# EAGLE design roomba (EAGLE 9.2.0)
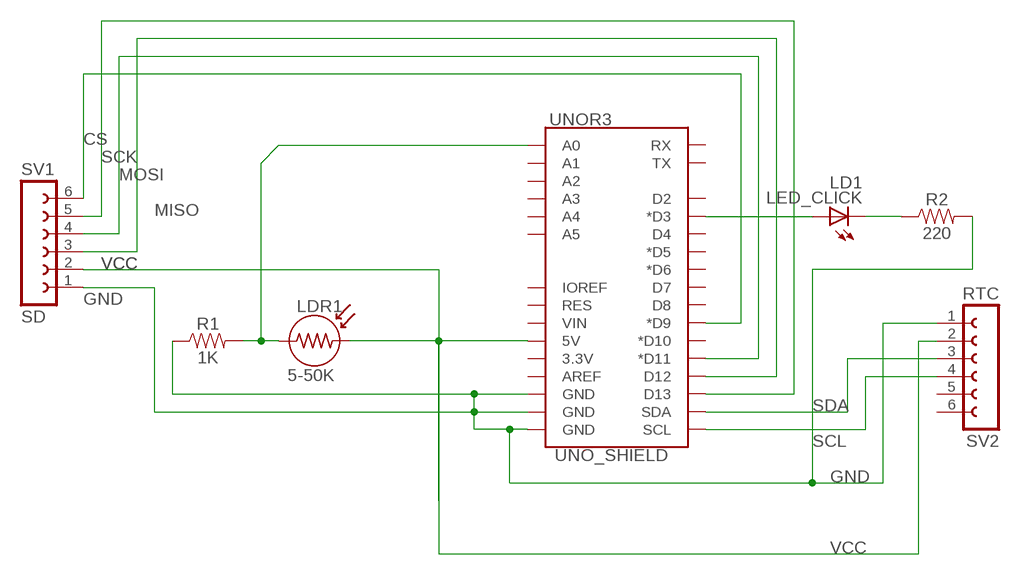
[diagram p0: schematic, sheet 1]

## Parts
LDR1  5-50K  LDR  [LDR]
LED_CLICK  LD1  LED3MM  [LED3MM]
R1  1K  1KOHM-HORIZ-1/4W-1%  [AXIAL-0.3]
R2  220  1KOHM-HORIZ-1/4W-1%  [AXIAL-0.3]
SV1  SD  FE06-1  [FE06]
SV2  RTC  FE06W  [FE06W]
UNOR3  UNO_SHIELD  ARDUINO_UNO_R3_SHIELDNOLABELS  [UNO_R3_SHIELD_NOLABELS]

## Nets
CLICK: LED_CLICK.A UNOR3.D3(*D3)
CS: SV1.6 UNOR3.D9(*D9)
GND: R1.P$1 R2.P$2 SV1.1 SV2.1 UNOR3.GND@0(GND) UNOR3.GND@1(GND) UNOR3.GND@2(GND)
LECTURA: LDR1.1 R1.P$2 UNOR3.A0
MISO: SV1.3 UNOR3.D12
MOSI: SV1.4 UNOR3.D11(*D11)
RCLICK: LED_CLICK.K(C) R2.P$1
SCK: SV1.5 UNOR3.D13
SCL: SV2.4 UNOR3.SCL
SDA: SV2.3 UNOR3.SDA
VCC: LDR1.2 SV1.2 SV2.2 UNOR3.5V
Unconnected: SV2.5 SV2.6 UNOR3.3.3V UNOR3.A1 UNOR3.A2 UNOR3.A3 UNOR3.A4 UNOR3.A5 UNOR3.AREF UNOR3.D2 UNOR3.D4 UNOR3.D5(*D5) UNOR3.D6(*D6) UNOR3.D7 UNOR3.D8 UNOR3.D10(*D10) UNOR3.IOREF UNOR3.RES UNOR3.RX UNOR3.TX UNOR3.VIN

## Library data of the parts
LDR1 = E&R_Sensores:LDR: Fotoresistencia
LED_CLICK = led:LED: LED OSRAM: - CHIPLED LG R971, LG N971, LY N971, LG Q971, LY Q971, LO R971, LY R971 LH N974, LH R974 LS Q976, LO Q976, LY Q976 LO Q996 - Hyper CHIPLED LW Q18S LB Q993, LB Q99A, LB R99A - SideLED LS A670, LO A670, LY A670, LG A670, LP A670 LB A673, LV A673, LT A673, LW A673 LH A674 LY A675 LS A676, LA A676, LO A676, LY A676, LW A676 LS A679, LY A679, LG A679 - Hyper Micro SIDELED® LS Y876, LA Y876, LO Y876, LY Y876 LT Y87S - SmartLED LW L88C, LW L88S LB L89C, LB L89S, LG L890 LS L89K, LO L89K, LY L89K LS L896, LA L896, LO L896, LY L896 - TOPLED LS T670, LO T670, LY T670, LG T670, LP T670 LSG T670, LSP T670, LSY T670, LOP T670, LYG T670 LG T671, LOG T671, LSG T671 LB T673, LV T673, LT T673, LW T673 LH T674 LS T676, LA T676, LO T676, LY T676, LB T676, LH T676, LSB T676, LW T676 LB T67C, LV T67C, LT T67C, LS T67K, LO T67K, LY T67K, LW E67C LS E67B, LA E67B, LO E67B, LY E67B, LB E67C, LV E67C, LT E67C LW T67C LS T679, LY T679, LG T679 LS T770, LO T770, LY T770, LG T770, LP T770 LB T773, LV T773, LT T773, LW T773 LH T774 LS E675, LA E675, LY E675, LS T675 LS T776, LA T776, LO T776, LY T776, LB T776 LHGB T686 LT T68C, LB T68C - Hyper Mini TOPLED® LB M676 - Mini TOPLED Santana® LG M470 LS M47K, LO M47K, LY M47K Source: http://www.osram.convergy.de LUXEON: - LUMILED® LXK2-PW12-R00, LXK2-PW12-S00, LXK2-PW14-U00, LXK2-PW14-V00 LXK2-PM12-R00, LXK2-PM12-S00, LXK2-PM14-U00 LXK2-PE12-Q00, LXK2-PE12-R00, LXK2-PE12-S00, LXK2-PE14-T00, LXK2-PE14-U00 LXK2-PB12-K00, LXK2-PB12-L00, LXK2-PB12-M00, LXK2-PB14-N00, LXK2-PB14-P00, LXK2-PB14-Q00 LXK2-PR12-L00, LXK2-PR12-M00, LXK2-PR14-Q00, LXK2-PR14-R00 LXK2-PD12-Q00, LXK2-PD12-R00, LXK2-PD12-S00 LXK2-PH12-R00, LXK2-PH12-S00 LXK2-PL12-P00, LXK2-PL12-Q00, LXK2-PL12-R00 Source: www.luxeon.com KINGBRIGHT: KA-3528ASYC Source: www.kingbright.com
R1 R2 = SparkFun-Resistors:1KOHM: 1kΩ resistor A resistor is a passive two-terminal electrical component that implements electrical resistance as a circuit element. Resistors act to reduce current flow, and, at the same time, act to lower voltage levels within circuits. - Wikipedia; PROD_ID: RES-12182; SPICEPREFIX: R; VALUE: 1k
SV1 = con-lsta:FE06-1: FEMALE HEADER; OC_FARNELL: unknown; OC_NEWARK: unknown
SV2 = con-lsta:FE06W: FEMALE HEADER; OC_FARNELL: unknown; OC_NEWARK: unknown
UNOR3 = SparkFun-Boards:ARDUINO_UNO_R3_SHIELD: Arduino R3 Shield Footprint Shield form compatible with the Arduino Uno R3. SparkFun Products: MG2639 Cellular Shield <https://www.sparkfun.com/products/13120> MIDI Shield <https://www.sparkfun.com/products/12898> R3 Stackable Headers Kit <https://www.sparkfun.com/products/11417>

## Board
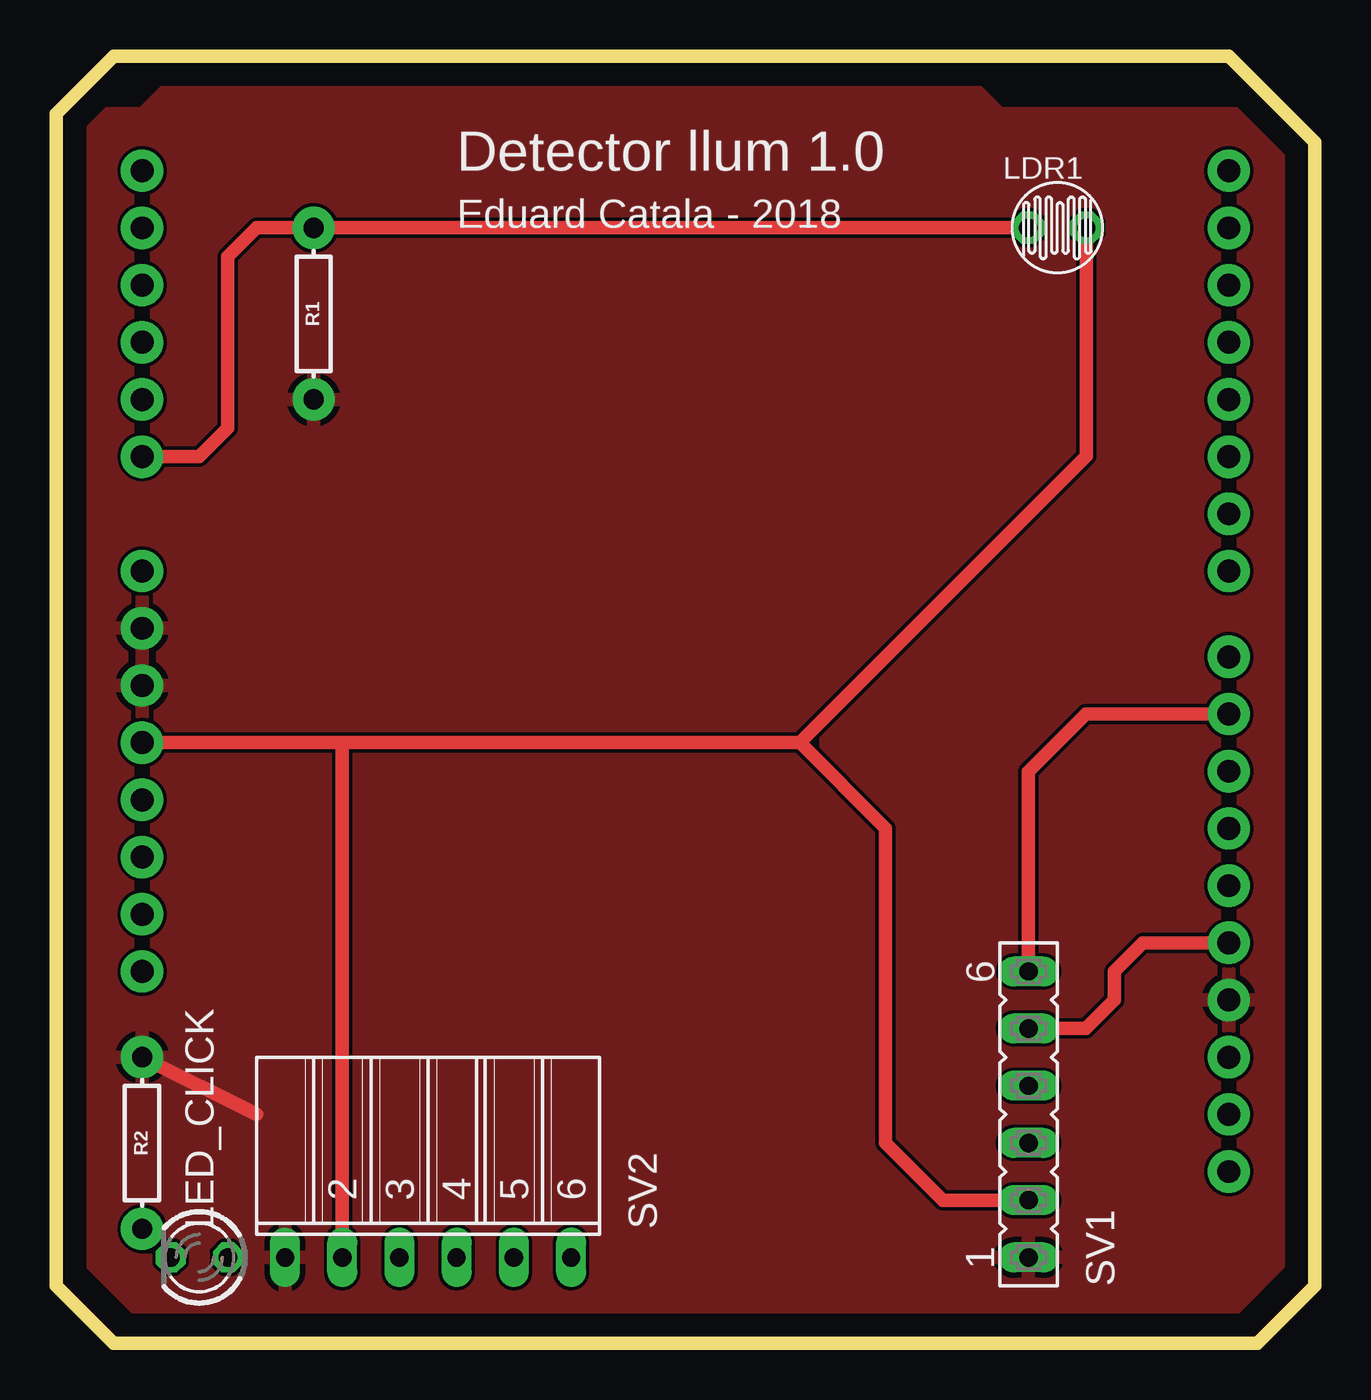
[diagram p1: board, top side]
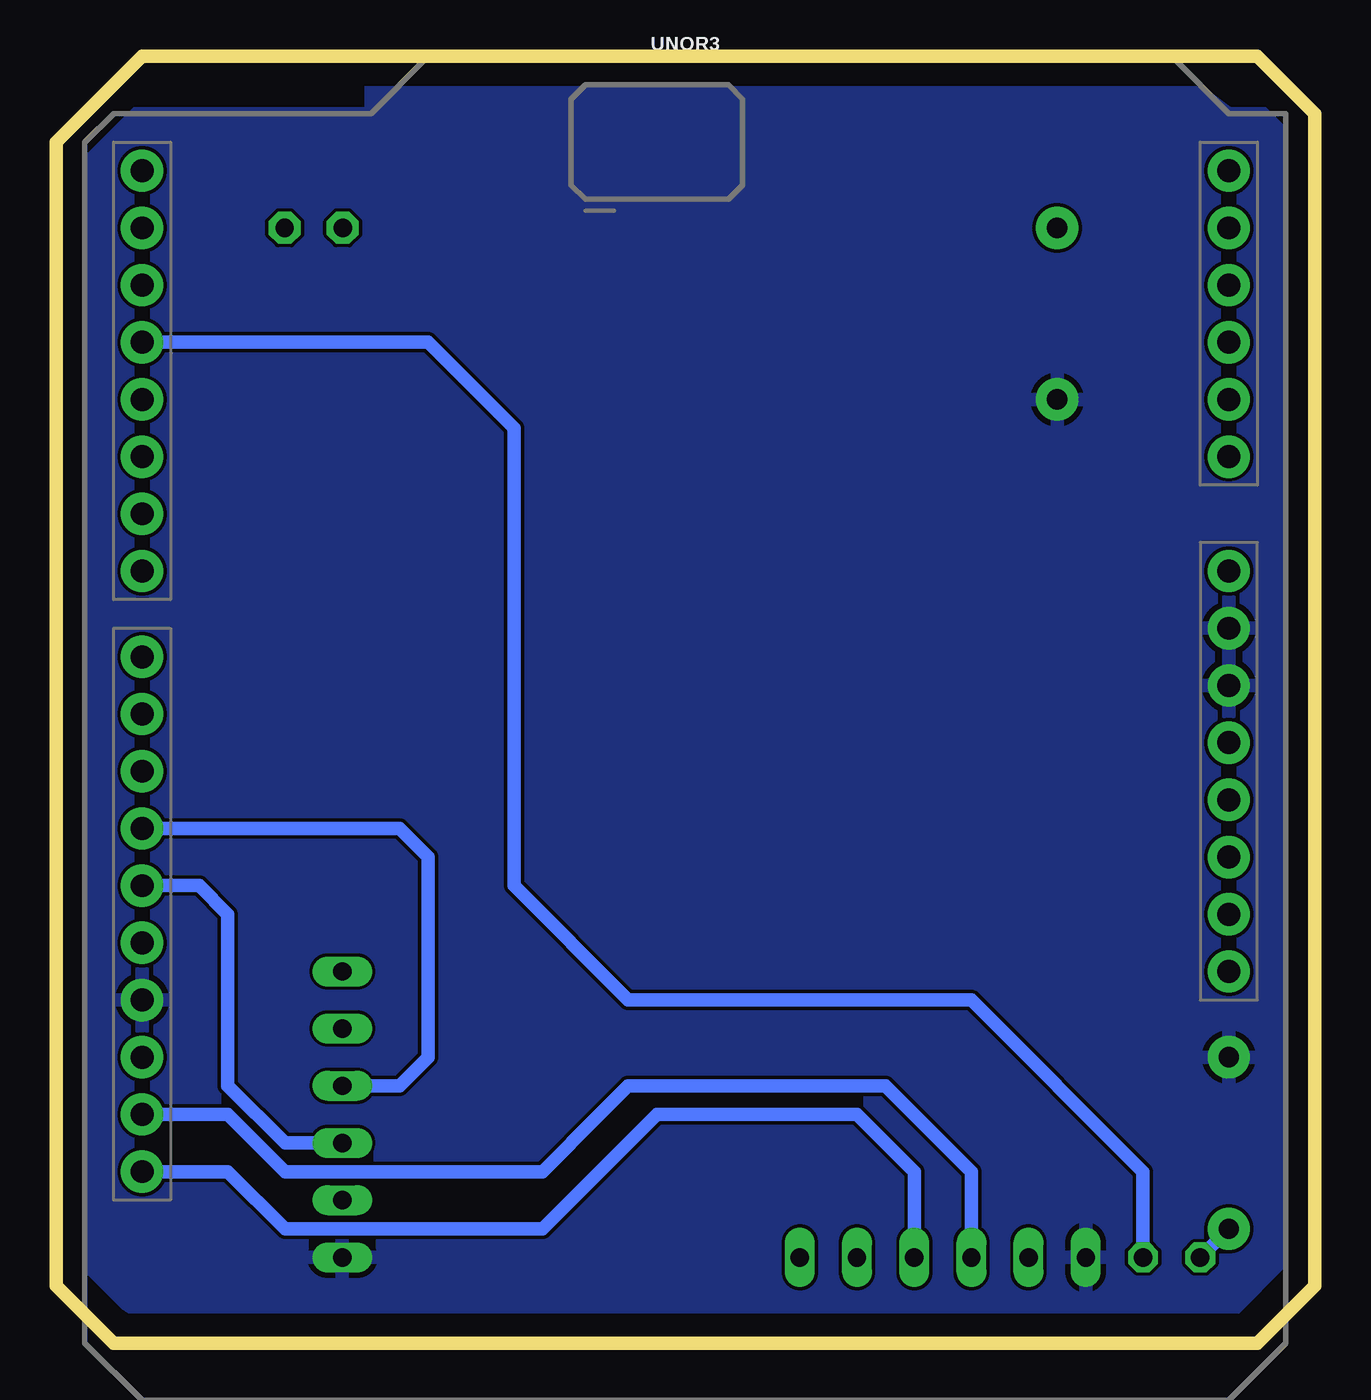
[diagram p2: board, bottom side, seen from below]

Size 55.88 x 57.15 mm. Coordinates in mm from the lower left corner, seen from the top.
Outline: 0,54.61 0,2.54 2.54,0 53.34,0 55.88,2.54 55.88,53.34 52.07,57.15 2.54,57.15 0,54.61
Copper layers (1*16): Top 0.035mm / dielectric 1.5mm / Bottom 0.035mm
Design rules "default": minimum track width 6mil, minimum drill 0.35mm, track to track 6mil, track to pad 6mil, pad to pad 6mil, via to via 6mil, smd to smd 6mil, copper to edge 40mil, drill to drill 6mil, minimum pad ring 10mil, minimum via ring 8mil, stop-mask expansion 4mil, vias tented up to drill 0mil, thermal gap 10mil

### Footprints (pad centres in the part's own frame; a part is rotated, then mirrored left to right if it is on the bottom)
LDR = drill 0.813 pad 1.422 octagon: 1 -1.29,0; 2 1.29,0
LED3MM = drill 0.813 octagon: A -1.27,0; K 1.27,0
AXIAL-0.3 = drill 0.9 pad 1.88: P$1 -3.81,0; P$2 3.81,0
FE06 = drill 0.813 long: 1 -6.35,0; 2 -3.81,0; 3 -1.27,0; 4 1.27,0; 5 3.81,0; 6 6.35,0
FE06W = drill 0.813 long: 1 -6.35,0; 2 -3.81,0; 3 -1.27,0; 4 1.27,0; 5 3.81,0; 6 6.35,0
UNO_R3_SHIELD_NOLABELS = drill 1.016 pad 1.88: 3.3V 24.13,-3.81; 5V 24.13,-1.27; A0 24.13,11.43; A1 24.13,13.97; A2 24.13,16.51; A3 24.13,19.05; A4 24.13,21.59; A5 24.13,24.13; AREF -24.13,-15.24; D2 -24.13,19.05; D3 -24.13,16.51; D4 -24.13,13.97; D5 -24.13,11.43; D6 -24.13,8.89; D7 -24.13,6.35; D8 -24.13,2.54; D9 -24.13,0; D10 -24.13,-2.54; D11 -24.13,-5.08; D12 -24.13,-7.62; D13 -24.13,-10.16; GND@0 24.13,1.27; GND@1 24.13,3.81; GND@2 -24.13,-12.7; IOREF 24.13,-8.89; NC 24.13,-11.43; RES 24.13,-6.35; RX -24.13,24.13; SCL -24.13,-20.32; SDA -24.13,-17.78; TX -24.13,21.59; VIN 24.13,6.35

### Placement (x,y rotation side)
LDR1  44.45,49.53 0 top
LED_CLICK  6.35,3.81 180 top
R1  11.43,45.72 90 top
R2  3.81,8.89 90 top
SV1  43.18,10.16 90 top
SV2  16.51,3.81 0 top
UNOR3  27.94,27.94 0 bottom

### Tracks (layer width: path | path; a pad name or v marks a point on that pad's centre or on a via)
CLICK
  Bottom 0.61: LED_CLICK.A 7.62,7.62 15.24,15.24 30.48,15.24 35.56,20.32 35.56,40.64 39.37,44.45 UNOR3.D3
CS
  Top 0.61: SV1.6 43.18,25.4 45.72,27.94 UNOR3.D9
GND
  Top 0.61: 8.89,10.16 R2.P$2
  pour Top: 54.61,3.81 52.07,1.27 3.81,1.27 1.27,3.81 1.27,54.61 3.81,54.61 6.35,57.15 39.37,57.15 41.91,54.61 53.34,54.61 54.61,53.34
  pour Bottom: 1.27,54.61 3.81,54.61 8.89,58.42 41.91,58.42 41.91,54.61 53.34,54.61 55.88,53.34 55.88,3.81 52.07,1.27 3.81,1.27 1.27,3.81
LECTURA
  Top 0.61: UNOR3.A0 6.35,39.37 7.62,40.64 7.62,48.26 8.89,49.53 R1.P$2 24.13,49.53 LDR1.1
MISO
  Bottom 0.61: SV1.3 45.72,8.89 48.26,11.43 48.26,19.05 49.53,20.32 UNOR3.D12
MOSI
  Bottom 0.61: SV1.4 40.64,11.43 39.37,12.7 39.37,21.59 40.64,22.86 UNOR3.D11
RCLICK
  Bottom 0.61: LED_CLICK.K R2.P$1
SCK
  Top 0.61: SV1.5 45.72,13.97 46.99,15.24 46.99,16.51 48.26,17.78 UNOR3.D13
SCL
  Bottom 0.61: SV2.4 17.78,7.62 20.32,10.16 29.21,10.16 34.29,5.08 45.72,5.08 48.26,7.62 UNOR3.SCL
SDA
  Bottom 0.61: SV2.3 15.24,7.62 19.05,11.43 30.48,11.43 31.75,10.16 34.29,7.62 45.72,7.62 48.26,10.16 UNOR3.SDA
VCC
  Top 0.61: SV1.2 39.37,6.35 36.83,8.89 36.83,22.86 33.02,26.67 | UNOR3.5V 12.7,26.67 | 12.7,26.67 33.02,26.67 | 33.02,26.67 45.74,39.39 LDR1.2 | SV2.2 12.7,26.67

### Text on the board
tNames: Detector llum 1.0 | Eduard Catala - 2018